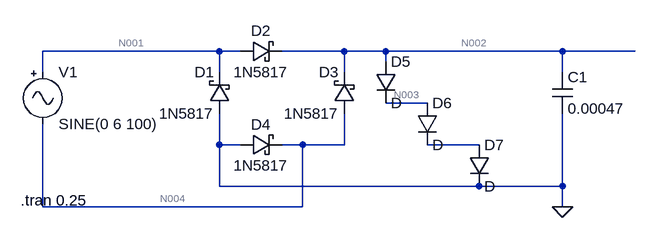
[diagram p0: schematic Brückenschaltung mit Kondensator und Begrenzung.asc]
Brückenschaltung mit Kondensator und Begrenzung.asc, the LTspice schematic file:
Version 4
SHEET 1 1252 680
WIRE 608 160 336 160
WIRE 640 160 608 160
WIRE 800 160 704 160
WIRE 864 160 800 160
WIRE 1136 160 864 160
WIRE 1248 160 1136 160
WIRE 864 176 864 160
WIRE 336 192 336 160
WIRE 608 192 608 160
WIRE 800 192 800 160
WIRE 1136 192 1136 160
WIRE 928 240 864 240
WIRE 608 304 608 256
WIRE 640 304 608 304
WIRE 736 304 704 304
WIRE 800 304 800 256
WIRE 800 304 736 304
WIRE 1008 304 928 304
WIRE 608 368 608 304
WIRE 1008 368 608 368
WIRE 1136 368 1136 256
WIRE 1136 368 1008 368
WIRE 336 400 336 272
WIRE 736 400 736 304
WIRE 736 400 336 400
WIRE 1136 400 1136 368
FLAG 1136 400 0
SYMBOL Misc\\signal 336 176 R0
WINDOW 123 0 0 Left 2
WINDOW 39 0 0 Left 2
SYMATTR InstName V1
SYMATTR Value SINE(0 6 100)
SYMBOL schottky 624 256 R180
WINDOW 0 24 64 Left 2
WINDOW 3 24 0 Left 2
SYMATTR InstName D1
SYMATTR Value 1N5817
SYMATTR Description Diode
SYMATTR Type diode
SYMBOL schottky 640 176 R270
WINDOW 0 32 32 VTop 2
WINDOW 3 0 32 VBottom 2
SYMATTR InstName D2
SYMATTR Value 1N5817
SYMATTR Description Diode
SYMATTR Type diode
SYMBOL schottky 816 256 R180
WINDOW 0 24 64 Left 2
WINDOW 3 24 0 Left 2
SYMATTR InstName D3
SYMATTR Value 1N5817
SYMATTR Description Diode
SYMATTR Type diode
SYMBOL schottky 640 320 R270
WINDOW 0 32 32 VTop 2
WINDOW 3 0 32 VBottom 2
SYMATTR InstName D4
SYMATTR Value 1N5817
SYMATTR Description Diode
SYMATTR Type diode
SYMBOL cap 1120 192 R0
SYMATTR InstName C1
SYMATTR Value 0.00047
SYMBOL diode 848 176 R0
SYMATTR InstName D5
SYMBOL diode 912 240 R0
SYMATTR InstName D6
SYMBOL diode 992 304 R0
SYMATTR InstName D7
TEXT 302 390 Left 2 !.tran 0.25

The netlist it stands for:
* Brückenschaltung mit Kondensator und Begrenzung.asc
V1 N001 N004 SINE(0 6 100)
D1 0 N001 1N5817
D2 N001 N002 1N5817
D3 N004 N002 1N5817
D4 0 N004 1N5817
C1 N002 0 0.00047
D5 N002 N003 D
D6 N003 N005 D
D7 N005 0 D
.model D D
.lib standard.dio
.tran 0.25
.backanno
.end

* Results of the author's LTspice run, read from the files saved beside the schematic
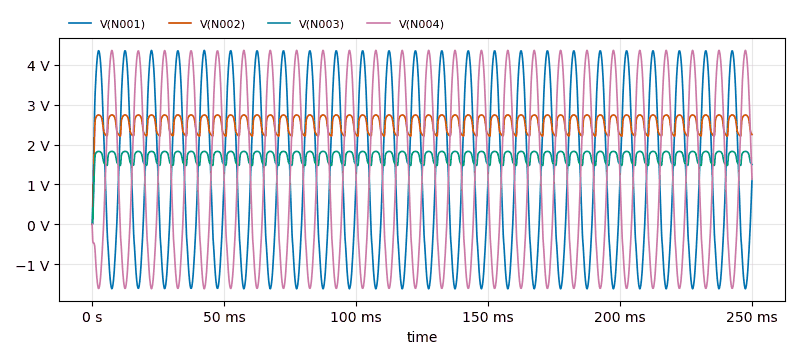
[diagram p1: Transient Analysis of Brückenschaltung mit Kondensator und Begrenzung.asc, plotted from the saved traces]
* Transient Analysis, 1 run:
*   V(N001): min -1.621 V, max 4.363 V, average 1.266 V, rms 2.464 V, last 1.125 V
*   V(N002): min 0 V, max 2.743 V, average 2.532 V, rms 2.543 V, last 2.25 V
*   V(N003): min 0 V, max 1.828 V, average 1.688 V, rms 1.695 V, last 1.5 V
*   V(N004): min -1.621 V, max 4.364 V, average 1.266 V, rms 2.465 V, last 1.125 V